# EAGLE design Hahnentrittstulpe (EAGLE 6.4)
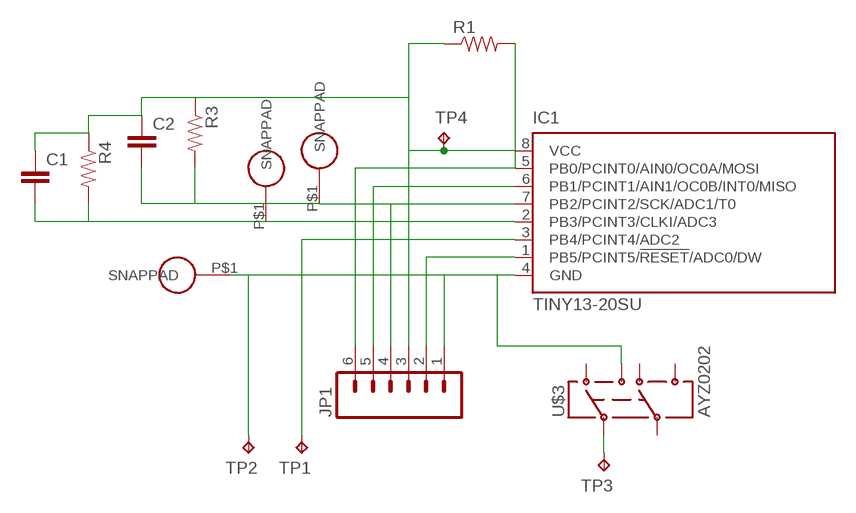
[diagram p0: schematic, sheet 1]

## Parts
C1  CAP0603-CAP  [0603-CAP]
C2  CAP0603-CAP  [0603-CAP]
IC1  TINY13-20SU  [8S2]
JP1  M06SMD  [1X06-SMD]
R1  RESISTOR1206  [1206]
R3  RESISTOR0402-RES  [0402-RES]
R4  RESISTOR0402-RES  [0402-RES]
TP1  TPTP18SQ  [TP18SQ]
TP2  TPTP18SQ  [TP18SQ]
TP3  TPTP18SQ  [TP18SQ]
TP4  TPTP18SQ  [TP18SQ]
U$1  SNAP-PAD_7MM_ROUND  [SNAP-PAD_7MM_RD]
U$2  SNAP-PAD_7MM_ROUND  [SNAP-PAD_7MM_RD]
U$3  AYZ0202  [AYZ0202]
U$4  SNAP-PAD_7MM_ROUND  [SNAP-PAD_7MM_RD]

## Nets
N$1: IC1.1(PB5/PCINT5/!RESET!/ADC0/DW) JP1.2
N$2: IC1.3(PB4/PCINT4/ADC2) TP1.TP
N$3: C1.2 IC1.2(PB3/PCINT3/CLKI/ADC3) R4.2 U$1.P$1(SNAPPAD)
N$5: C2.2 IC1.7(PB2/PCINT2/SCK/ADC1/T0) JP1.4 R3.2 U$2.P$1(SNAPPAD)
N$6: IC1.4(GND) JP1.1 TP2.TP U$3.1 U$4.P$1(SNAPPAD)
N$7: C1.1 C2.1 IC1.8(VCC) JP1.3 R1.1 R3.1 R4.1 TP4.TP
N$10: IC1.6(PB1/PCINT1/AIN1/OC0B/INT0/MISO) JP1.5
N$11: IC1.5(PB0/PCINT0/AIN0/OC0A/MOSI) JP1.6 R1.2
N$21: TP3.TP U$3.2
Unconnected: U$3.3 U$3.4 U$3.5 U$3.6

## Library data of the parts
C1 C2 = SparkFun-Capacitors:CAP: Capacitor Standard 0603 ceramic capacitor, and 0.1" leaded capacitor.
IC1 = atmel:TINY13: 8-bit AVR Microcontroller with 1K Bytes In-System Programmable Flash Source: http://www.atmel.com/dyn/resources/prod_documents/2535S.pdf; MPN: ATTINY13-20SU; OC_FARNELL: 9171568; OC_NEWARK: 96K6522
JP1 = SparkFun-Connectors:M06: Header 6 Standard 6-pin 0.1" header. Use with straight break away headers (SKU : PRT-00116), right angle break away headers (PRT-00553), swiss pins (PRT-00743), machine pins (PRT-00117), and female headers (PRT-00115). Molex polarized connector foot print use with SKU : PRT-08094 with associated crimp pins and housings. NOTES ON THE VARIANTS LOCK and LOCK_LONGPADS... This footprint was designed to help hold the alignment of a through-hole component (i.e. 6-pin header) while soldering it into place. You may notice that each hole has been shifted either up or down by 0.005 of an inch from it's more standard position (which is a perfectly straight line). This slight alteration caused the pins (the squares in the middle) to touch the edges of the holes. Because they are alternating, it causes a "brace" to hold the component in place. 0.005 has proven to be the perfect amount of "off-center" position when using our standard breakaway headers. Although looks a little odd when you look at the bare footprint, once you have a header in there, the alteration is very hard to notice. Also,if you push a header all the way into place, it is covered up entirely on the bottom side. This idea of altering the position of holes to aid alignment will be further integrated into the Sparkfun Library for other footprints. It can help hold any component with 3 or more connection pins.
R1 = SparkFun-Resistors:RESISTOR: Resistor Basic schematic elements and footprints for 0603, 1206, and PTH resistors.
R3 R4 = SparkFun-Passives:RESISTOR: Resistor Basic schematic elements and footprints for 0603, 1206, and PTH resistors.
TP1-TP4 = testpad:TP: Test pad
U$1 U$2 U$4 = hannahsEagleLib:SNAP-PAD_7MM_ROUND
U$3 = SparkFun-Electromechanical:AYZ0202: SPDT Slide Switch Simple SMD single-pull double-throw slide switch. Good for less than 350mA power switch, switching UARTs between devices, etc. Spark Fun Electronics SKU : COM-00597

## Board
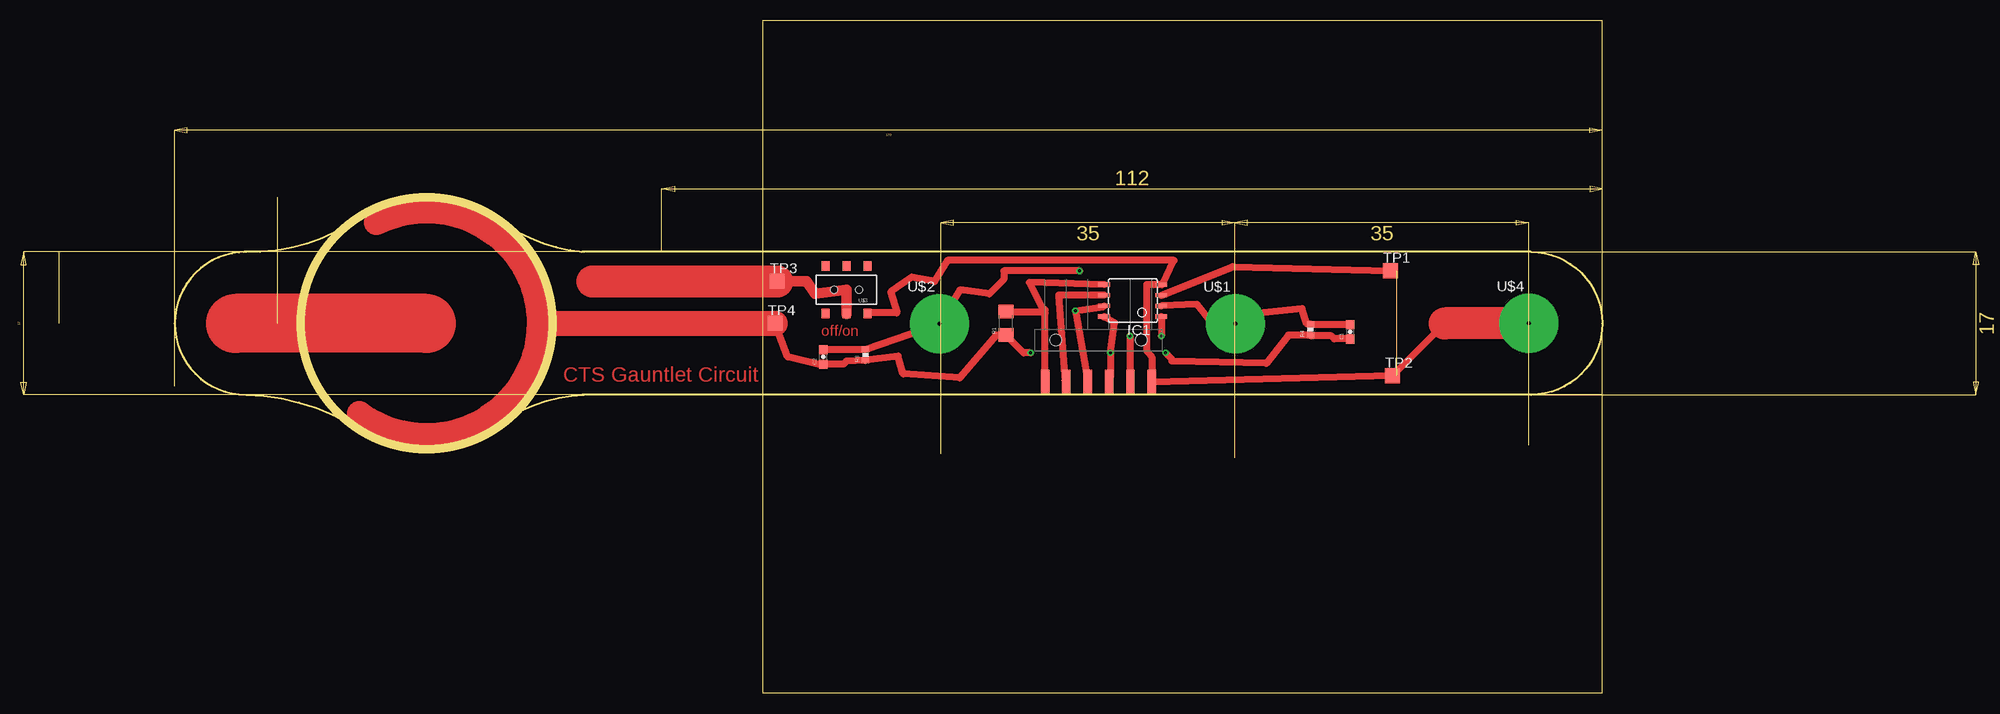
[diagram p1: board, top side]
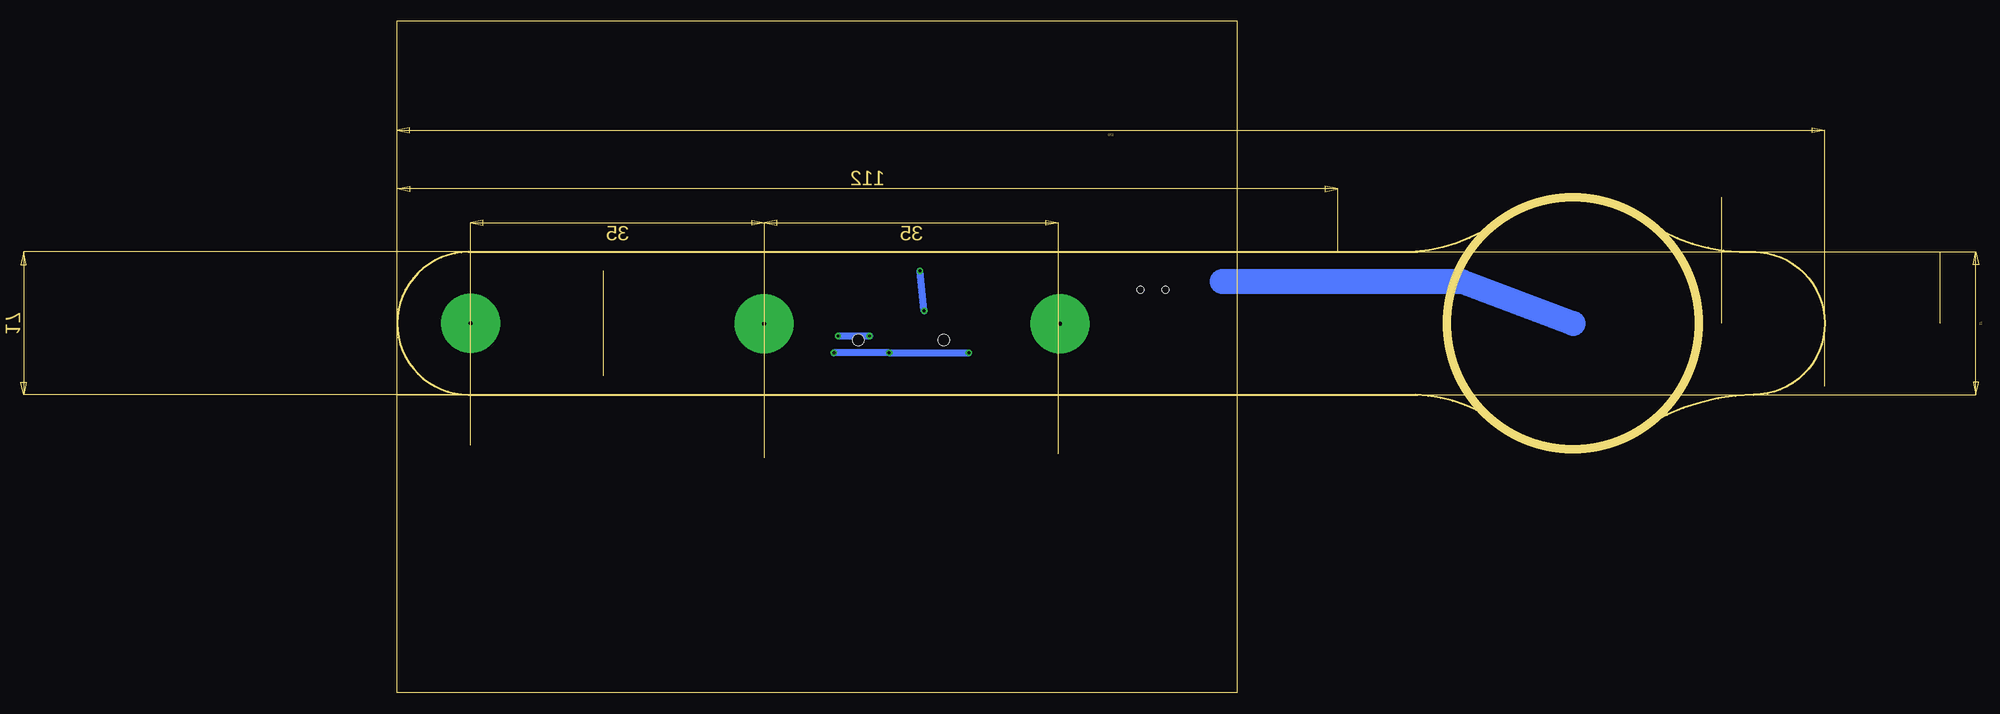
[diagram p2: board, bottom side, seen from below]

Size 154.98 x 80 mm. Coordinates in mm from the lower left corner, seen from the top.
Outline: 154.98,0 154.98,80 54.98,80 54.98,0 154.98,0
Outline: circle at 14.98,44 radius 14.98
Copper layers (1*16): Top 0.035mm / dielectric 1.5mm / Bottom 0.035mm
Design rules "default": minimum track width 10mil, minimum drill 24mil, track to track 8mil, track to pad 8mil, pad to pad 8mil, via to via 8mil, smd to smd 8mil, copper to edge 40mil, drill to drill 8mil, minimum pad ring 10mil, minimum via ring 8mil, stop-mask expansion 4mil, vias tented up to drill 0mil, thermal gap 10mil
Milling: 10 lines

### Footprints (pad centres in the part's own frame; a part is rotated, then mirrored left to right if it is on the bottom)
0603-CAP = smd 1.1 x 1: 1 -0.85,0; 2 0.85,0
8S2 = smd 0.5 x 1.4: 1 -1.905,-3.404; 2 -0.645,-3.404; 3 0.625,-3.404; 4 1.895,-3.404; 5 1.905,3.404; 6 0.635,3.404; 7 -0.635,3.404; 8 -1.905,3.404
1X06-SMD = smd 1 x 3: 1 -6.35,5; 2 -3.81,5; 3 -1.27,5; 4 1.27,5; 5 3.81,5; 6 6.35,5 | hole 1.4: -5.08,0; 5.08,0
1206 = smd 1.6 x 1.8: 1 -1.4,0; 2 1.4,0
0402-RES = smd 0.7 x 0.9: 1 -0.65,0; 2 0.65,0
TP18SQ = smd 1.8 x 1.8: TP 0,0
SNAP-PAD_7MM_RD = drill 0.5 pad 7: P$1 0,0
AYZ0202 = smd 1 x 1.15: 1 -2.5,2.825; 2 0,2.825; 3 2.5,2.825; 4 -2.5,-2.825; 5 0,-2.825; 6 2.5,-2.825 | hole 0.85: 1.5,0; -1.5,0

### Placement (x,y rotation side)
C1  124.98,43 90 top
C2  62.23,40 90 top
IC1  99.06,46.72 90 top
JP1  94.98,42 180 top
R1  83.98,44 90 top
R3  67.23,40.25 90 top
R4  120.23,43.25 90 top
TP1  129.73,50.25 0 top
TP2  129.98,37.75 0 top
TP3  56.73,49 0 top
TP4  56.48,44 0 top
U$1  111.3,43.94 0 top
U$2  76.05,43.97 0 top
U$3  64.98,48 180 top
U$4  146.23,44 0 top

### Tracks (layer width: path | path; a pad name or v marks a point on that pad's centre or on a via)
N$1  (via drill 0.35)  (1 unrouted)
  Top 0.813: IC1.1 102.48,44.81 v102.48,42.5 | 98.73,37 JP1.2 98.79,42.44 98.73,42.5
  Bottom 0.813: v102.48,42.5 98.73,42.5
N$2
  Top 0.813: IC1.3 110.98,50.75 TP1.TP
N$3
  Top 0.813: C1.2 120.28,43.85 R4.2 119.83,43.9 119.23,45.75 112.36,45 U$1.P$1 108.54,43.94 106.73,46.25 IC1.2
N$5  (via drill 0.35)
  Top 0.813: 93.73,37.02 v92.23,45.5 95.57,46 IC1.7 | v92.73,50.25 83.73,50.25 83.73,49.25 81.98,47.5 78.48,48 U$2.P$1 R3.2 62.28,40.9 C2.2
  Top 1.016: 93.73,37.02 arc-90 JP1.4
  Bottom 0.813: v92.23,45.5 v92.73,50.25
N$6
  Top 0.813: 136.23,44 TP2.TP JP1.1 101.33,40 100.73,40.75 100.73,48.62 IC1.4 102.59,48.62 103.98,51.5 76.98,51.5 75.48,49 72.73,49.5 70.23,47.75 70.98,45.25 67.55,45.25 U$3.1
  Top 3.81: U$4.P$1 136.23,44
N$7  (via drill 0.35)  (1 unrouted)
  Top 0.813: JP1.3 arc-90 96.4,37.59 v96.4,40.5 96.9,44.06 IC1.8 95.59,44.75 | C1.1 123.08,42.15 122.73,42.5 120.33,42.5 R4.1 117.58,42.6 114.98,39.25 103.73,39.5 103.73,39.75 102.98,40.5 | TP4.TP 57.98,40 62.08,39 C2.1 64.63,39.15 64.98,39.5 R3.1 71.13,40.1 71.73,38 78.48,37.5 82.83,42.6 R1.1 86.08,40.5 v86.9,40.5
  Top 3: 28.48,44 TP4.TP
  Bottom 0.813: 102.98,40.5 v96.4,40.5 v86.9,40.5
N$10
  Top 0.813: IC1.6 90.23,47.35 90.98,37.19 JP1.5
N$11
  Top 0.813: IC1.5 86.73,48.88 88.23,46 88.63,45.6 88.63,45.25 | JP1.6 88.63,45.25 | R1.2 88.48,45.4 88.63,45.25
N$15
  Bottom 3: 56.73,49 28.23,49 14.98,44
N$16  (via drill 0.35)
  other vias: 102.48,42.5
N$17  (via drill 0.35)
  other vias: 98.73,42.5
N$18
  Top 3: 8.98,56 arc-243 6.98,33.25
N$19  (via drill 0.35)
  other vias: 102.98,40.5
N$20
  Top 7: 14.98,44 -7.77,44
N$21
  Top 1.27: TP3.TP 60.23,49 61.23,47.5 64.98,48 U$3.2
  Top 3.81: 34.73,49 TP3.TP

### Text on the board
Top: off/on | CTS Gauntlet Circuit